# EAGLE design obd_driver_module (EAGLE 6.5.0)
DESCRIPTION: OBD-II, MS CAN, SW CAN Drivers; HW_REV: 1.1; PCB_REV: B; TITLE: OBD Driver Module

## Sheet 1 of 4
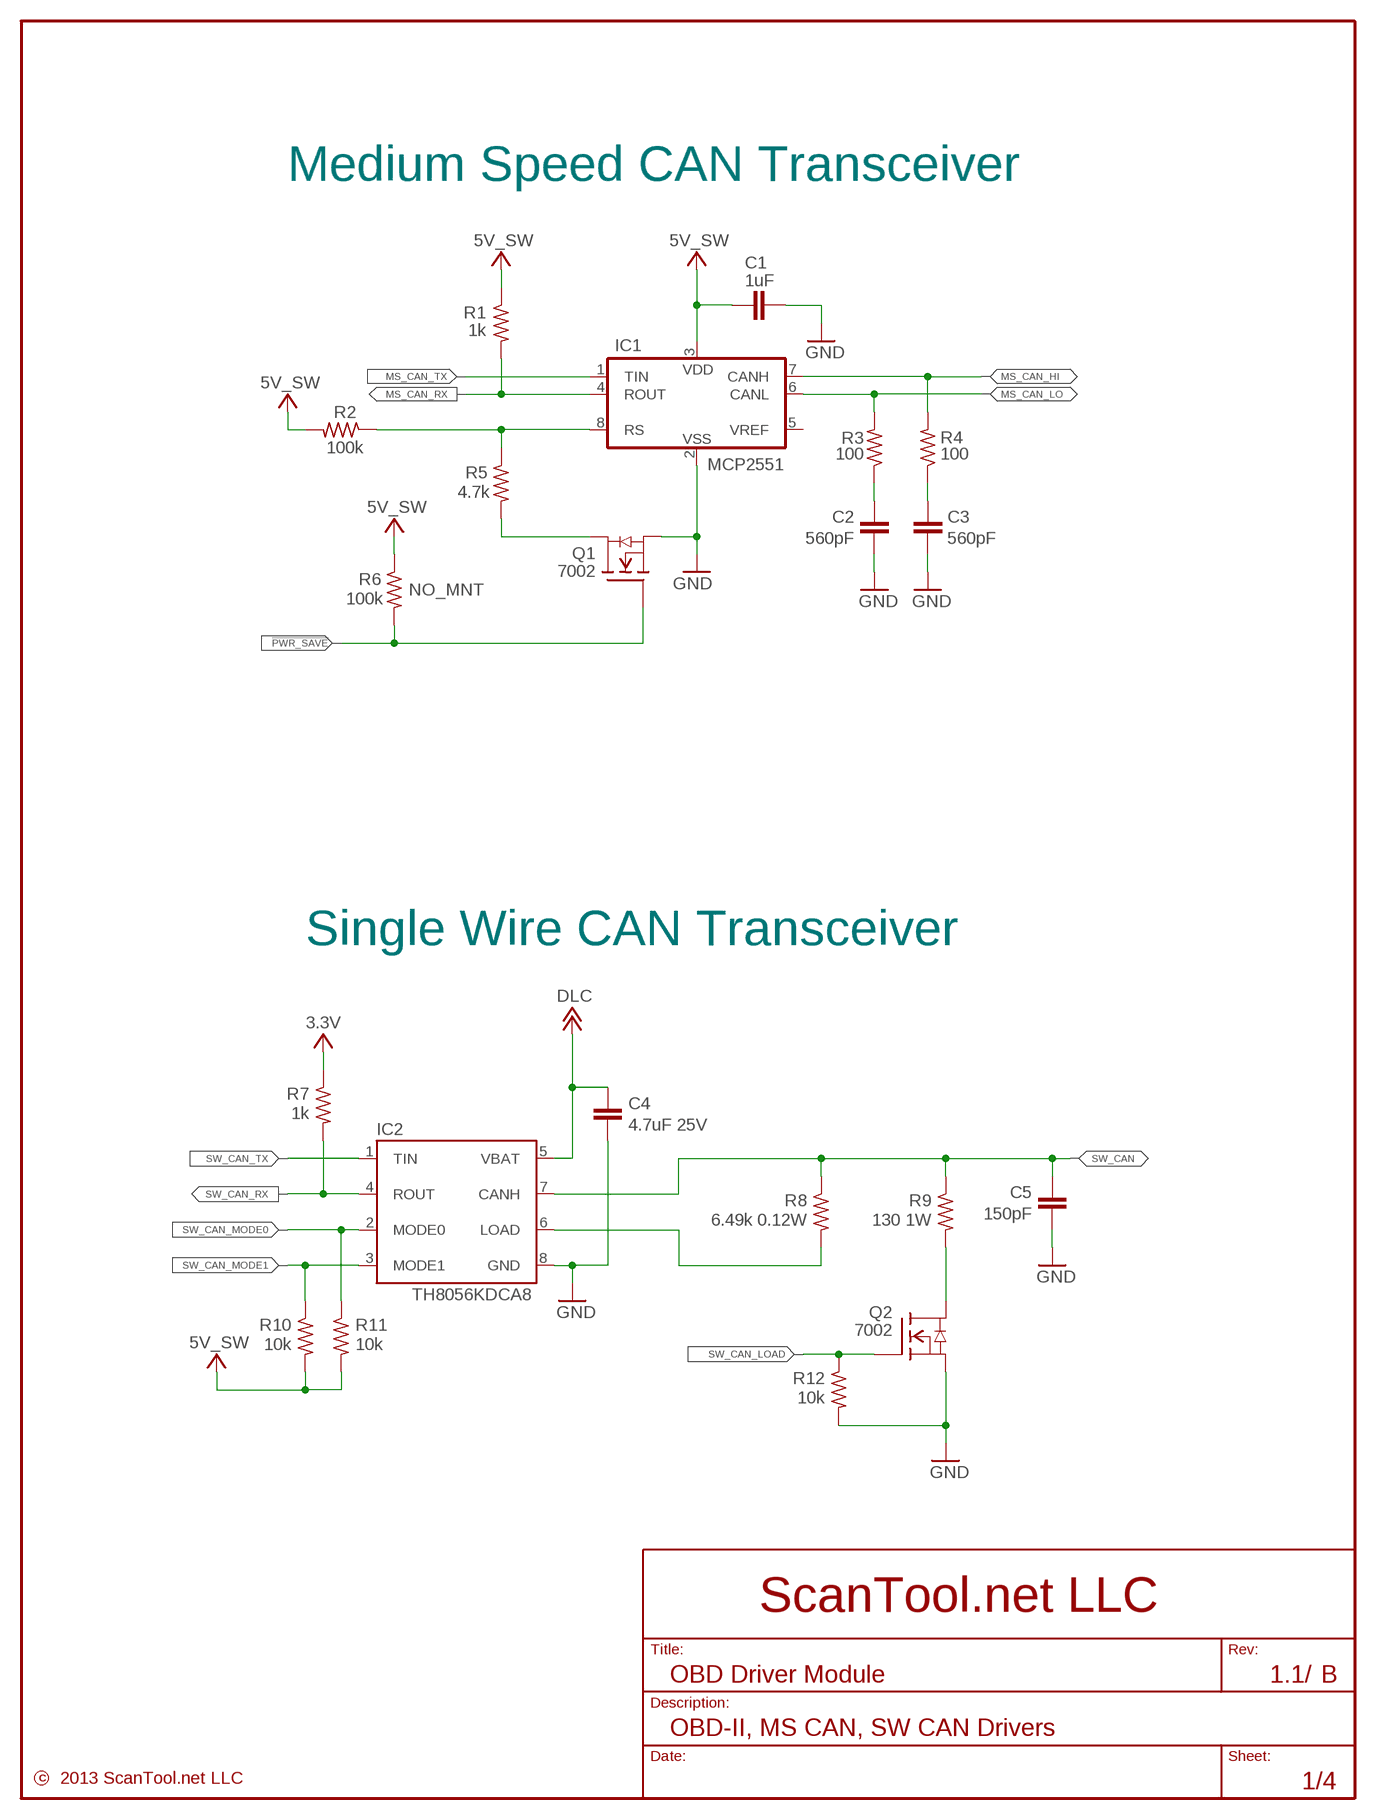
[diagram p0: schematic, sheet 1]

### Parts
C1  1uF  C-EU_0603  [0603]
C2  560pF  C-EU_0603  [0603]
C3  560pF  C-EU_0603  [0603]
C4  4.7uF 25V  C-EU_0805  [0805]
C5  150pF  C-EU_0603  [0603]
IC1  MCP2551  MCP2551-I/SN  [SO-8]
IC2  TH8056KDCA8  [SO-8]
Q1  7002  2N7002W  [SOT323-3]
Q2  7002  2N7002W  [SOT323-3]
R1  1k  R-US_0603  [0603]
R2  100k  R-US_0603  [0603]
R3  100  R-US_0603  [0603]
R4  100  R-US_0603  [0603]
R5  4.7k  R-US_0603  [0603]
R6  100k  R-US_0603  [0603]
R7  1k  R-US_0603  [0603]
R8  6.49k 0.12W  R-US_0603  [0603]
R9  130 1W  R-US_2512  [2512]
R10  10k  R-US_0603  [0603]
R11  10k  R-US_0603  [0603]
R12  10k  R-US_0603  [0603]

### Nets
3.3V [Supply]: R7.1 ; also sheet 2,3,4
5V_SW [Supply]: C1.1 IC1.3(VDD) R1.1 R2.2 R6.1 R10.2 R11.2 ; also sheet 2,3,4
!PWR_SAVE: Q1.1(G) R6.2 ; also sheet 3,4
DLC [Supply]: C4.2 IC2.5(VBAT) ; also sheet 3,4
GND [Supply]: C1.2 C2.2 C3.2 C4.1 C5.1 IC1.2(VSS) IC2.8(GND) Q1.2(S) Q2.2(S) R12.2 ; also sheet 2,3,4
MS_CAN_HI: IC1.7(CANH) R4.2 ; also sheet 4
MS_CAN_LO: IC1.6(CANL) R3.2 ; also sheet 4
MS_CAN_RX: IC1.4(ROUT) R1.2 ; also sheet 4
MS_CAN_TX: IC1.1(TIN) ; also sheet 4
N$5: C2.1 R3.1
N$7: C3.1 R4.1
N$8: IC1.8(RS) R2.1 R5.1
N$9 [Supply]: Q1.3(D) R5.2
N$41: IC2.6(LOAD) R8.2
N$45 [Signal-small]: Q2.3(D) R9.P$2
SW_CAN: C5.2 IC2.7(CANH) R8.1 R9.P$1 ; also sheet 4
SW_CAN_LOAD: Q2.1(G) R12.1 ; also sheet 4
SW_CAN_MODE0: IC2.2(MODE0) R11.1 ; also sheet 4
SW_CAN_MODE1: IC2.3(MODE1) R10.1 ; also sheet 4
SW_CAN_RX: IC2.4(ROUT) R7.2 ; also sheet 4
SW_CAN_TX: IC2.1(TIN) ; also sheet 4
Unconnected: IC1.5(VREF)

### Notes on the sheet
- Medium Speed CAN Transceiver
- Single Wire CAN Transceiver

## Sheet 2 of 4
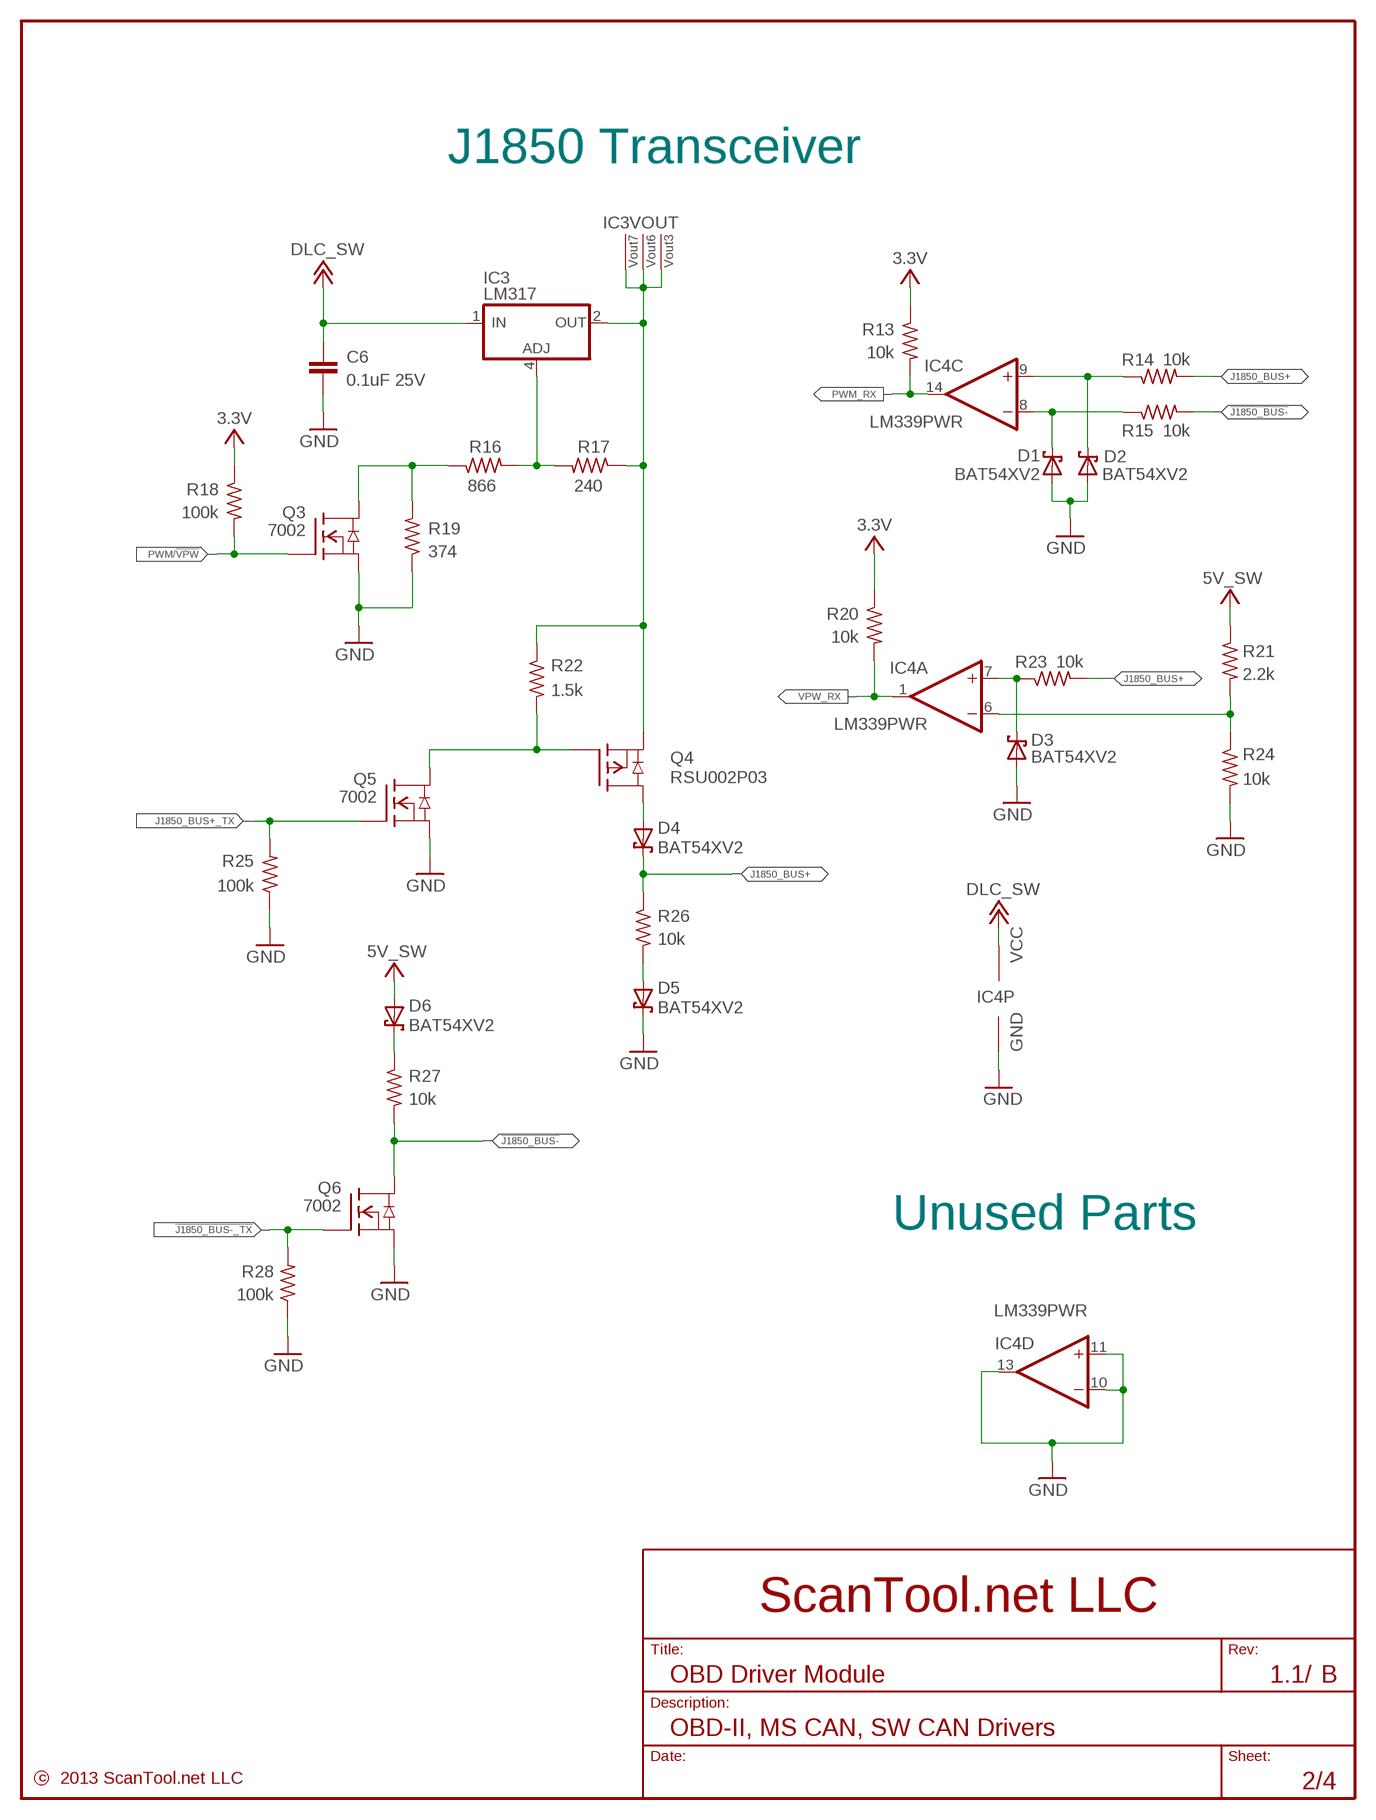
[diagram p1: schematic, sheet 2]

### Parts
C6  0.1uF 25V  C-EU_0603  [0603]
D1  BAT54XV2  [SOD-523F]
D2  BAT54XV2  [SOD-523F]
D3  BAT54XV2  [SOD-523F]
D4  BAT54XV2  [SOD-523F]
D5  BAT54XV2  [SOD-523F]
D6  BAT54XV2  [SOD-523F]
IC3  LM317  LM317LCPW  [TSSOP-8]
IC4  LM339PWR  [TSSOP-14]
Q3  7002  2N7002W  [SOT323-3]
Q4  RSU002P03  [SOT323-3]
Q5  7002  2N7002W  [SOT323-3]
Q6  7002  2N7002W  [SOT323-3]
R13  10k  R-US_0603  [0603]
R14  10k  R-US_0603  [0603]
R15  10k  R-US_0603  [0603]
R16  866  R-US_0603  [0603]
R17  240  R-US_0603  [0603]
R18  100k  R-US_0603  [0603]
R19  374  R-US_0603  [0603]
R20  10k  R-US_0603  [0603]
R21  2.2k  R-US_0603  [0603]
R22  1.5k  R-US_0603  [0603]
R23  10k  R-US_0603  [0603]
R24  10k  R-US_0603  [0603]
R25  100k  R-US_0603  [0603]
R26  10k  R-US_0603  [0603]
R27  10k  R-US_0603  [0603]
R28  100k  R-US_0603  [0603]

### Nets
3.3V [Supply]: R13.1 R18.1 R20.1 ; also sheet 1,3,4
5V_SW [Supply]: D6.A R21.1 ; also sheet 1,3,4
!J1850_BUS-: Q6.3(D) R15.2 R27.2 ; also sheet 4
!J1850_BUS-_TX: Q6.1(G) R28.2 ; also sheet 4
DLC_SW [Supply]: C6.1 IC3.1(IN) IC4.3(P:VCC) ; also sheet 3,4
GND [Supply]: C6.2 D1.A D2.A D3.A D5.C IC4.10(D:-IN) IC4.11(D:+IN) IC4.12(P:GND) IC4.13(D:OUT) Q3.2(S) Q5.2(S) Q6.2(S) R19.1 R24.2 R25.1 R28.1 ; also sheet 1,3,4
J1850_BUS+: D4.C R14.2 R23.2 R26.1 ; also sheet 4
J1850_BUS+_TX: Q5.1(G) R25.2 ; also sheet 4
N$6: D6.C R27.1
N$13: Q4.1(G) Q5.3(D) R22.2
N$16: Q3.3(D) R16.1 R19.2
N$18: D3.C IC4.7(A:+IN) R23.1
N$21: D5.A R26.2
N$26: IC3.4(ADJ) R16.2 R17.2
N$27: D4.A Q4.3(D)
N$29: D2.C IC4.9(C:+IN) R14.1
N$30: D1.C IC4.8(C:-IN) R15.1
N$43: IC4.6(A:-IN) R21.2 R24.1
OUT: IC3.2(OUT) IC3.3(OUT) IC3.6(OUT) IC3.7(OUT) Q4.2(S) R17.1 R22.1
PWM/!VPW: Q3.1(G) R18.2 ; also sheet 4
PWM_RX: IC4.14(C:OUT) R13.2 ; also sheet 4
VPW_RX: IC4.1(A:OUT) R20.2 ; also sheet 4

### Notes on the sheet
- J1850 Transceiver
- Unused Parts

## Sheet 3 of 4
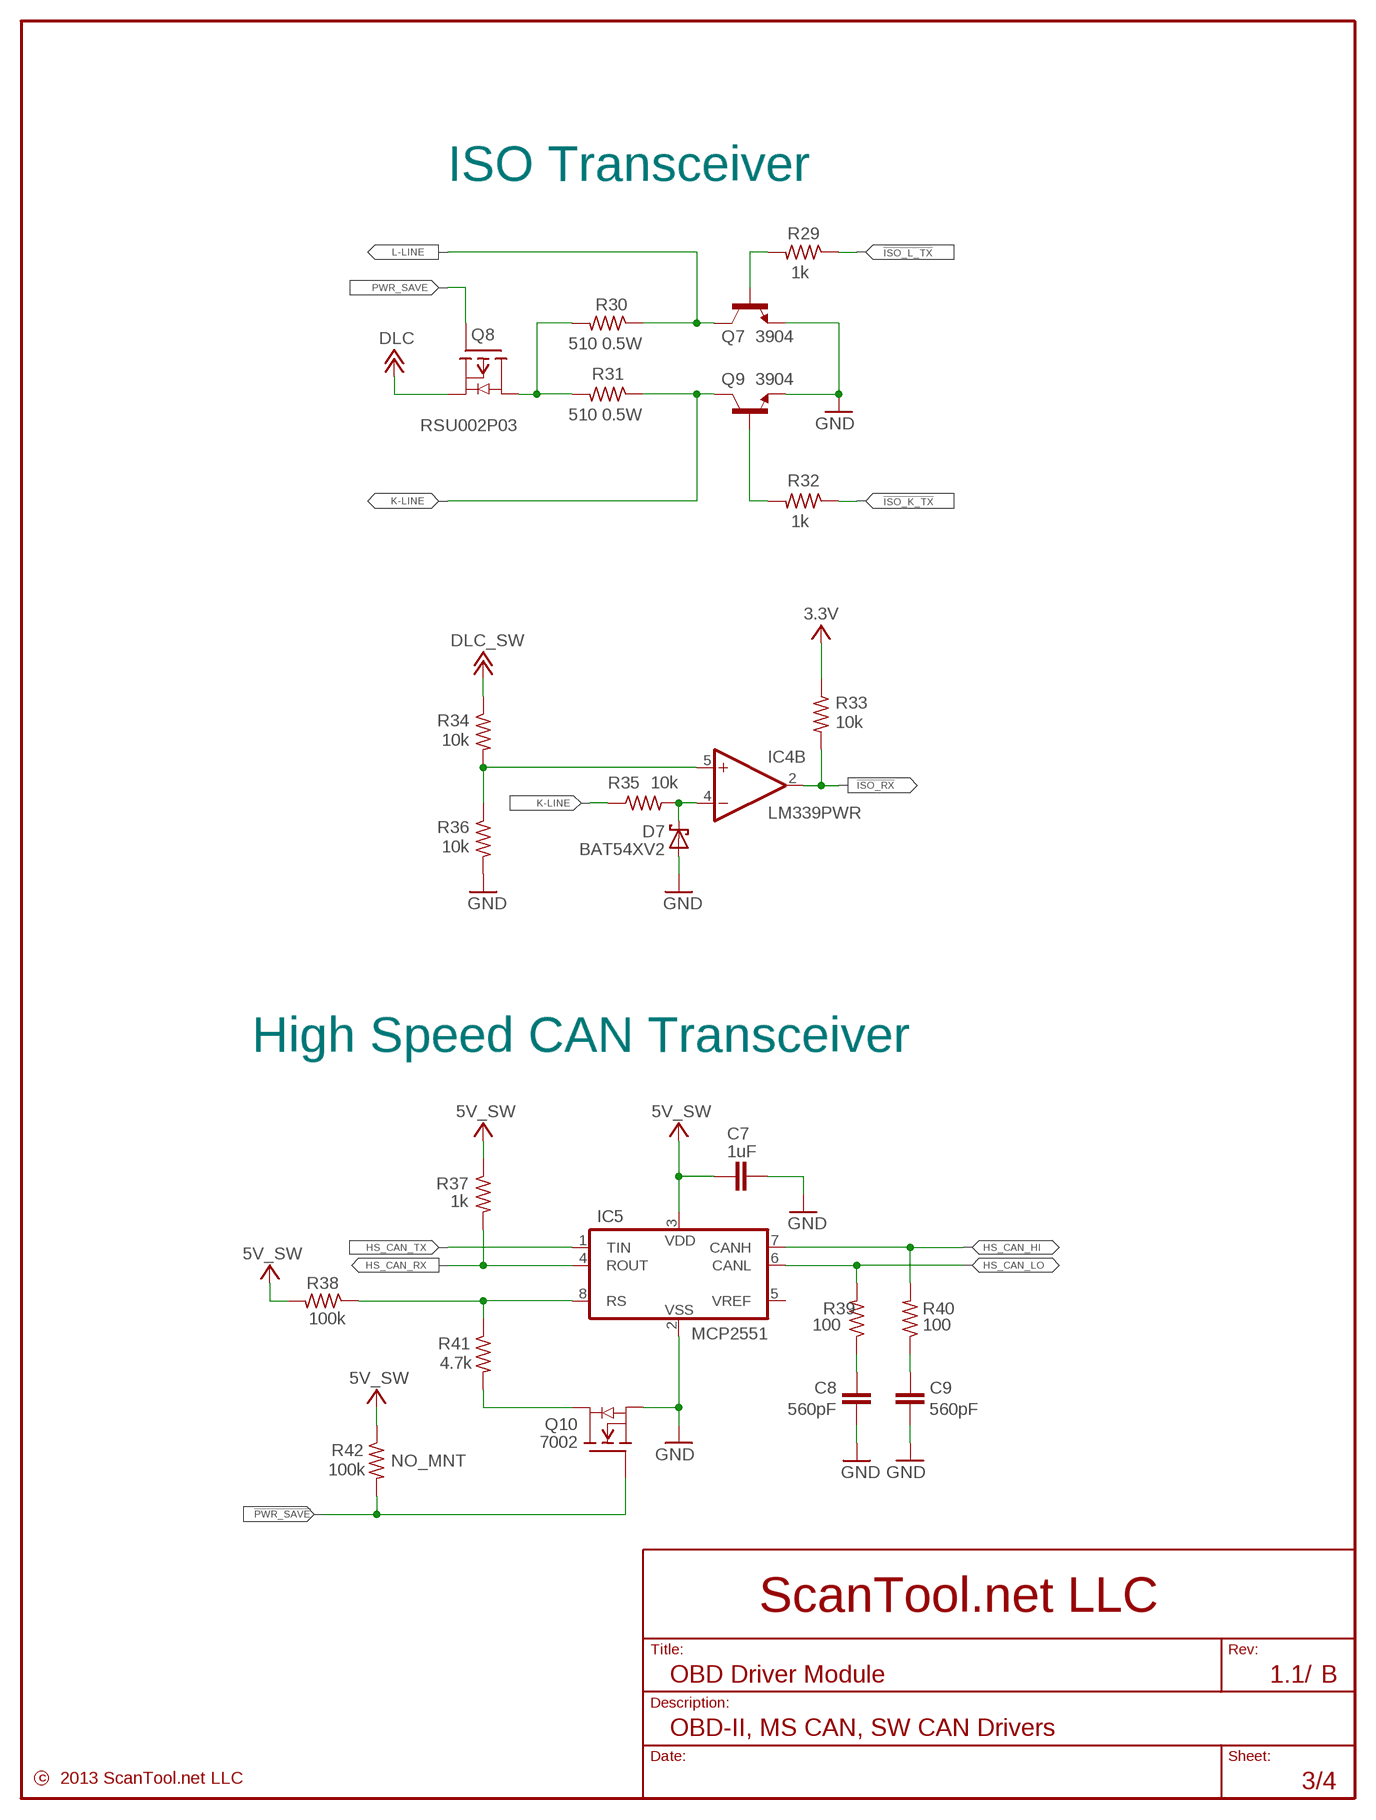
[diagram p2: schematic, sheet 3]

### Parts
C7  1uF  C-EU_0603  [0603]
C8  560pF  C-EU_0603  [0603]
C9  560pF  C-EU_0603  [0603]
D7  BAT54XV2  [SOD-523F]
IC5  MCP2551  MCP2551-I/SN  [SO-8]
Q7  3904  MMST3904  [SOT323-3]
Q8  RSU002P03  [SOT323-3]
Q9  3904  MMST3904  [SOT323-3]
Q10  7002  2N7002W  [SOT323-3]
R29  1k  R-US_0603  [0603]
R30  510 0.5W  R-US_1210  [1210]
R31  510 0.5W  R-US_1210  [1210]
R32  1k  R-US_0603  [0603]
R33  10k  R-US_0603  [0603]
R34  10k  R-US_0603  [0603]
R35  10k  R-US_0603  [0603]
R36  10k  R-US_0603  [0603]
R37  1k  R-US_0603  [0603]
R38  100k  R-US_0603  [0603]
R39  100  R-US_0603  [0603]
R40  100  R-US_0603  [0603]
R41  4.7k  R-US_0603  [0603]
R42  100k  R-US_0603  [0603]

### Nets
3.3V [Supply]: R33.1 ; also sheet 1,2,4
5V_SW [Supply]: C7.1 IC5.3(VDD) R37.1 R38.2 R42.1 ; also sheet 1,2,4
!ISO_K_TX: R32.1 ; also sheet 4
!ISO_L_TX: R29.1 ; also sheet 4
!ISO_RX: IC4.2(B:OUT) R33.2 ; also sheet 4
!PWR_SAVE: Q10.1(G) R42.2 ; also sheet 1,4
DLC [Supply]: Q8.2(S) ; also sheet 1,4
DLC_SW [Supply]: R34.1 ; also sheet 2,4
GND [Supply]: C7.2 C8.2 C9.2 D7.A IC5.2(VSS) Q7.2(E) Q9.2(E) Q10.2(S) R36.2 ; also sheet 1,2,4
HS_CAN_HI: IC5.7(CANH) R40.2 ; also sheet 4
HS_CAN_LO: IC5.6(CANL) R39.2 ; also sheet 4
HS_CAN_RX: IC5.4(ROUT) R37.2 ; also sheet 4
HS_CAN_TX: IC5.1(TIN) ; also sheet 4
K-LINE: Q9.3(C) R31.1 R35.1 ; also sheet 4
L-LINE: Q7.3(C) R30.1 ; also sheet 4
N$1: C8.1 R39.1
N$2: Q10.3(D) R41.2
N$3: Q7.1(B) R29.2
N$4 [Supply]: Q8.3(D) R30.2 R31.2
N$12: Q9.1(B) R32.2
N$14: D7.C IC4.4(B:-IN) R35.2
N$15: IC5.8(RS) R38.1 R41.1
N$19: IC4.5(B:+IN) R34.2 R36.1
N$40: C9.1 R40.1
PWR_SAVE: Q8.1(G) ; also sheet 4
Unconnected: IC5.5(VREF)

### Notes on the sheet
- ISO Transceiver
- High Speed CAN Transceiver

## Sheet 4 of 4
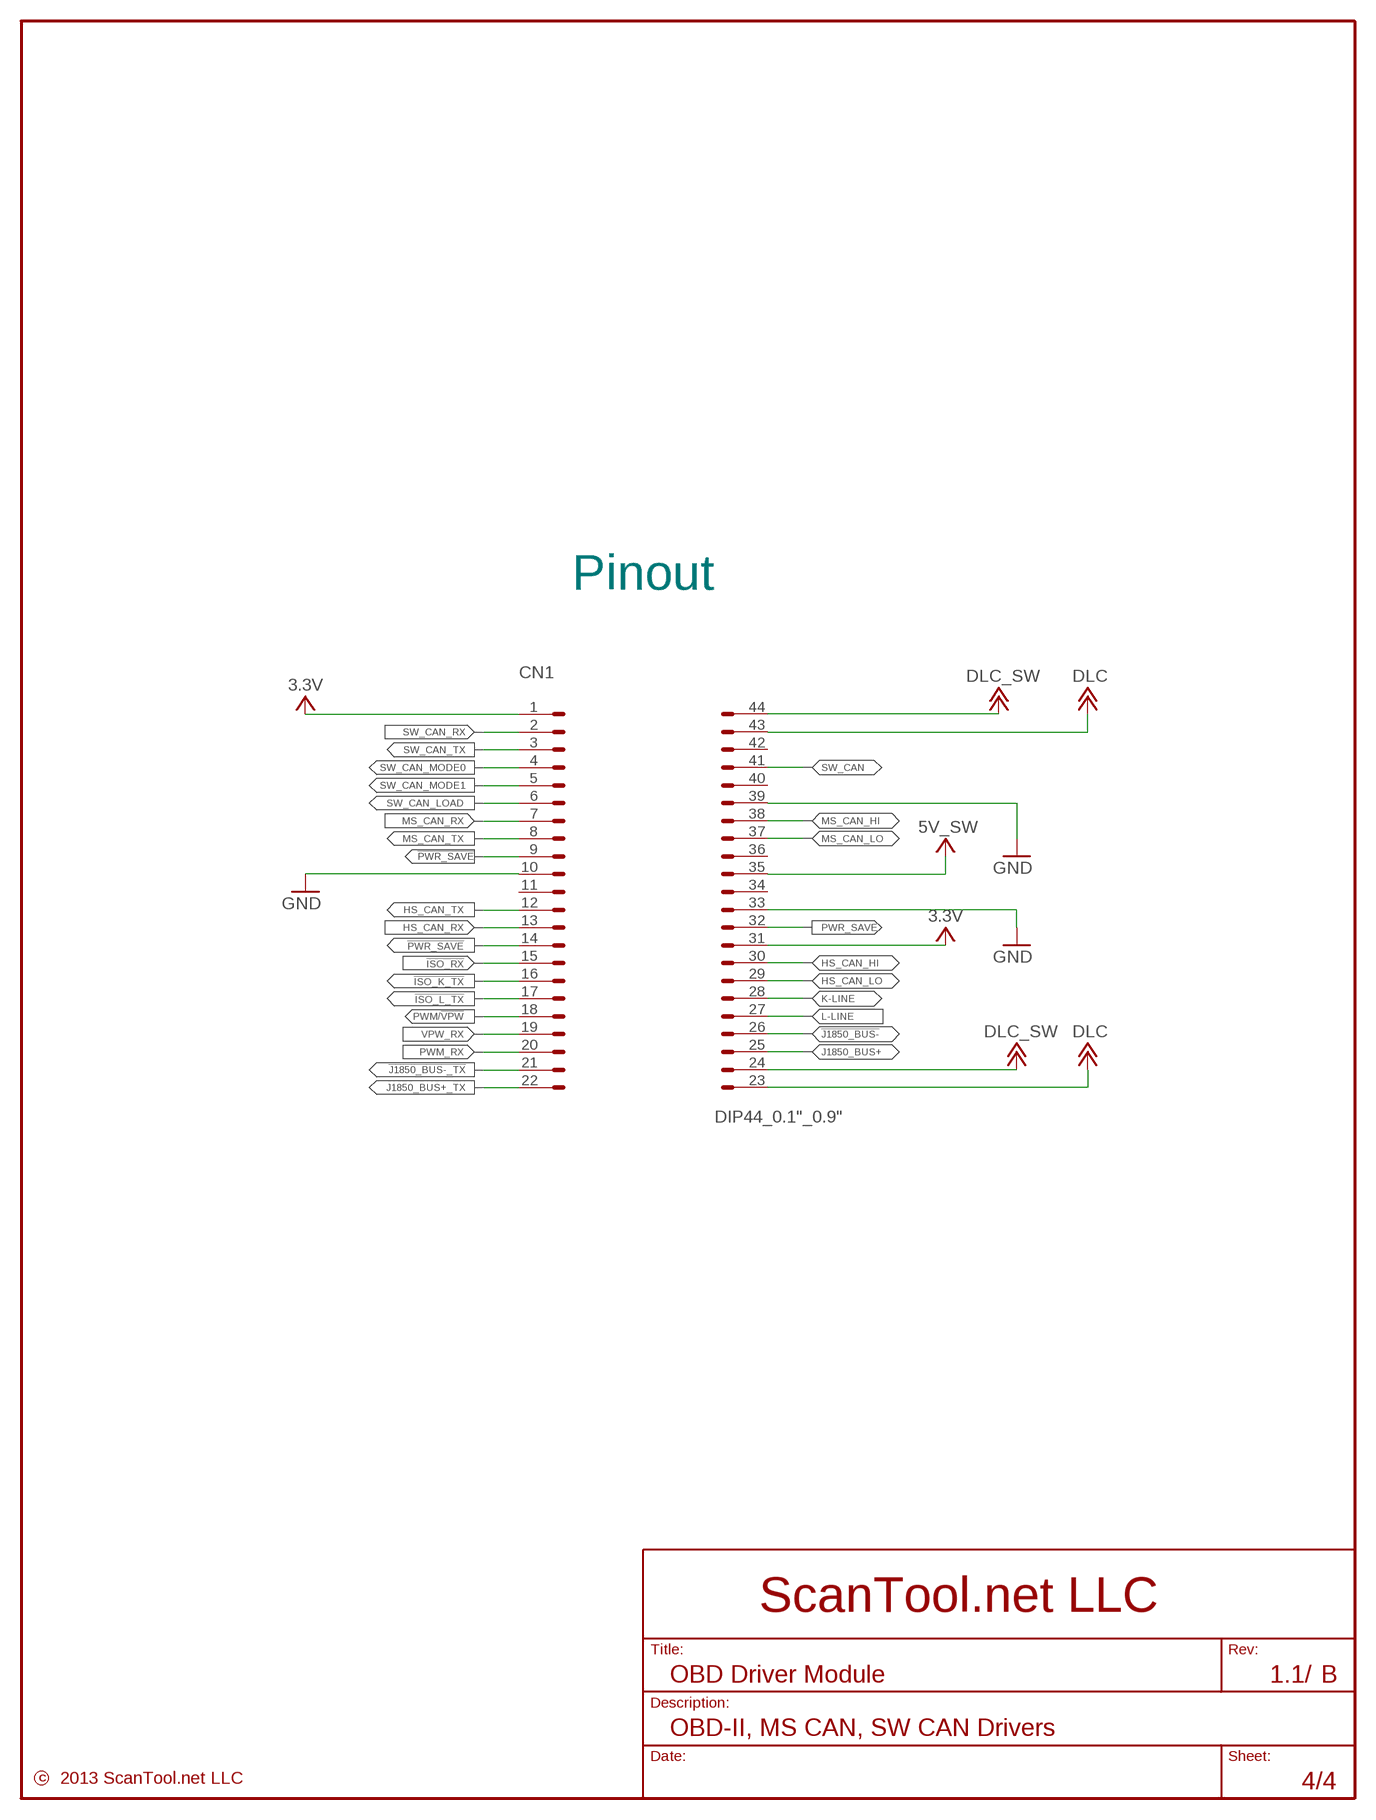
[diagram p3: schematic, sheet 4]

### Parts
CN1  DIP44_0.1"_0.9"  [DIP44_0.1"_0.9"]

### Nets
3.3V [Supply]: CN1.1 CN1.31 ; also sheet 1,2,3
5V_SW [Supply]: CN1.35 ; also sheet 1,2,3
!ISO_K_TX: CN1.16 ; also sheet 3
!ISO_L_TX: CN1.17 ; also sheet 3
!ISO_RX: CN1.15 ; also sheet 3
!J1850_BUS-: CN1.26 ; also sheet 2
!J1850_BUS-_TX: CN1.21 ; also sheet 2
!PWR_SAVE: CN1.9 CN1.14 ; also sheet 1,3
DLC [Supply]: CN1.23 CN1.43 ; also sheet 1,3
DLC_SW [Supply]: CN1.24 CN1.44 ; also sheet 2,3
GND [Supply]: CN1.10 CN1.33 CN1.39 ; also sheet 1,2,3
HS_CAN_HI: CN1.30 ; also sheet 3
HS_CAN_LO: CN1.29 ; also sheet 3
HS_CAN_RX: CN1.13 ; also sheet 3
HS_CAN_TX: CN1.12 ; also sheet 3
J1850_BUS+: CN1.25 ; also sheet 2
J1850_BUS+_TX: CN1.22 ; also sheet 2
K-LINE: CN1.28 ; also sheet 3
L-LINE: CN1.27 ; also sheet 3
MS_CAN_HI: CN1.38 ; also sheet 1
MS_CAN_LO: CN1.37 ; also sheet 1
MS_CAN_RX: CN1.7 ; also sheet 1
MS_CAN_TX: CN1.8 ; also sheet 1
PWM/!VPW: CN1.18 ; also sheet 2
PWM_RX: CN1.20 ; also sheet 2
PWR_SAVE: CN1.32 ; also sheet 3
SW_CAN: CN1.41 ; also sheet 1
SW_CAN_LOAD: CN1.6 ; also sheet 1
SW_CAN_MODE0: CN1.4 ; also sheet 1
SW_CAN_MODE1: CN1.5 ; also sheet 1
SW_CAN_RX: CN1.2 ; also sheet 1
SW_CAN_TX: CN1.3 ; also sheet 1
VPW_RX: CN1.19 ; also sheet 2
Unconnected: CN1.11 CN1.34 CN1.36 CN1.40 CN1.42

### Notes on the sheet
- Pinout

## Library data of the parts
C1-C9 = _stn_rcl:C-EU: Capacitor, European Symbol Change Log Date Author Change November 13, 2006 vit@scantool.net Moved underscore from the end of device name to beginning of variant names. May 27, 2006 vitaliy@scantool.net Added description; DESC: Capacitor; VALSTAT: VAL
CN1 = _stn_connector:DIP44_0.1": OBD-DRIVER-CONNECTOR Male, 22X2, 0.1" Pitch Based on 2 Standard 20X1 .01" pitch male headers. Change Log Date Author Change September 07, 2012 dduggan@scantool.net Device created.; DESC: Socket; PARTNUM: DIP 44 Pin Socket; VALSTAT: PARTNUM
D1-D7 = _stn_diode:BAT54: BAT54 Shotkey Diode Change Log Date Author Change September 26, 2012 dduggan @scantool.net Device created; DESC: Diode, Schottky; MANUF: Fairchild; PARTNUM: BAT54XV2; SUPPLIER: Digikey:BAT54XV2TR-ND; VALSTAT: PARTNUM
IC1 IC5 = _stn_microchip:MCP2551: CAN Driver Based on information from the MPC2551 datasheet from Microchip. http://www.microchip.com/ Note: with VDD dissconnected: TIN is a 5.45k to GND ROUT has 4.35k to GND Change Log Date Author Change November 12, 2008 joe@scantool.net Renamed "TXD" to "TIN" and "RXD" to "ROUT" Fixed mislabeled pins "CANH" and CANL"; DESC: IC, CAN Transceiver; MANUF: Microchip Technology; PARTNUM: MCP2551-I/SN; SUPPLIER: Digikey:MCP2551-I/SN-ND; VALSTAT: PARTNUM
IC2 = _stn_melexis:TH8056KDCA8: Single Wire CAN IC Based on information from the TH8056 datasheet from Melexis. Note: with VDD dissconnected: MODE0 has a 17.5k resistance to GND MODE1 has a 17.5k resistance to GND Change Log Date Author Change October 1, 2010 jason@scantool.net Created Device. February 2, 2011 jason@scantool.net Changed pin names to TIN and ROUT.; DESC: IC, Single Wire CAN; MANUF: Melexis; PARTNUM: TH8056KDCA8; SUPPLIER: Digikey:TH8056KDC-A8CT-ND; VALSTAT: PARTNUM
IC3 = _stn_vreg:LM317L*?: Voltage Regulator, Positive (Adjustable) Change Log Date Author Change November 15, 2010 dduggan @scantool.net Changed VOUT pins from request to must. May 15, 2006 vitaliy@scantool.net Moved to _stn_vreg.lbr from _st.lbr.; DESC: Voltage Reg. Adj.; MANUF: Texas Instruments; PARTNUM: LM317LCPWR; SUPPLIER: Digikey:296-17222-1-ND; VALSTAT: PARTNUM
IC4 = _stn_logic:LM339PWR: Quad Differential Comparators Based on information from the SLCS006N datasheet from TI (www.ti.com). Change Log Date Author Change July 16, 2008 joe@scantool.net Updated DESC. July 16, 2008 nick@scantool.net Device created.; DESC: IC, Comparator, Quad; MANUF: Texas Instruments; PARTNUM: LM339PWR; SUPPLIER: Digikey:296-6607-1-ND; VALSTAT: PARTNUM
Q1-Q3 Q5 Q6 Q10 = _stn_transistor:2N7002: MOSFET N_Channel Change Log Date Author Change July 9, 2008 joe@scantool.net Device package updated to revised SOT23 July 7, 2008 joe@scantool.net Created device.; DESC: Transistor, N-Channel; MANUF: ON Semiconductor; PARTNUM: 2N7002WT1G; SUBST: NO; SUPPLIER: Digikey:2N7002WT1GOSCT-ND; VALSTAT: PARTNUM
Q4 Q8 = _stn_transistor:RSU002P03; DESC: Transistor, P-Channel; MANUF: Rohm Semiconductor; PARTNUM: RSU002P03T106; SUPPLIER: Digikey:RSU002P03T106CT-ND; VALSTAT: PARTNUM
Q7 Q9 = _stn_transistor:?3904: PNP Transistor Low speed switching: 70nS On-Time, 250nS Off-Time (200mA Ic) Change Log Date Author Change June 30, 2010 jason@scantool.net Renamed device from 2N3904 to ?3904. April 5, 2010 joe@scantool.net Swapped collector and emitter pin assignments on SOT323-3 package April 5, 2010 joe@scantool.net Added Description.; DESC: Transistor, NPN; MANUF: ON Semiconductor; PARTNUM: MMBT3904WT1G; SUPPLIER: Digikey:MMBT3904WT1GOSCT-ND; VALSTAT: PARTNUM
R1-R8 R10-R42 = _stn_rcl:R-US: Resistor, US Symbol Change Log Date Author Change November 23, 2010 bpond@scantool.net Added 0309/12 package. November 18, 2010 vitaliy@scantool.net Verified device. November 18, 2010 bpond@scantool.net Added 0207/10 package. November 13, 2006 vit@scantool.net Moved underscore from the end of device name to beginning of variant names. May 27, 2006 vitaliy@scantool.net Added description.; DESC: Resistor; VALSTAT: VAL
R9 = _stn_rcl:R-US: Resistor, US Symbol Change Log Date Author Change November 23, 2010 bpond@scantool.net Added 0309/12 package. November 18, 2010 vitaliy@scantool.net Verified device. November 18, 2010 bpond@scantool.net Added 0207/10 package. November 13, 2006 vit@scantool.net Moved underscore from the end of device name to beginning of variant names. May 27, 2006 vitaliy@scantool.net Added description.; DESC: Resistor

## Net classes
0 Normal: width 0.254 mm, drill 0.406 mm, clearance 0.203 mm
1 Supply: width 0.254 mm, drill 0.457 mm, clearance 0.203 mm
2 Vdlc: width 0.254 mm, drill 0.457 mm, clearance 0.203 mm
3 Signal-small: width 0.254 mm, drill 0.457 mm, clearance 0.203 mm

## Board
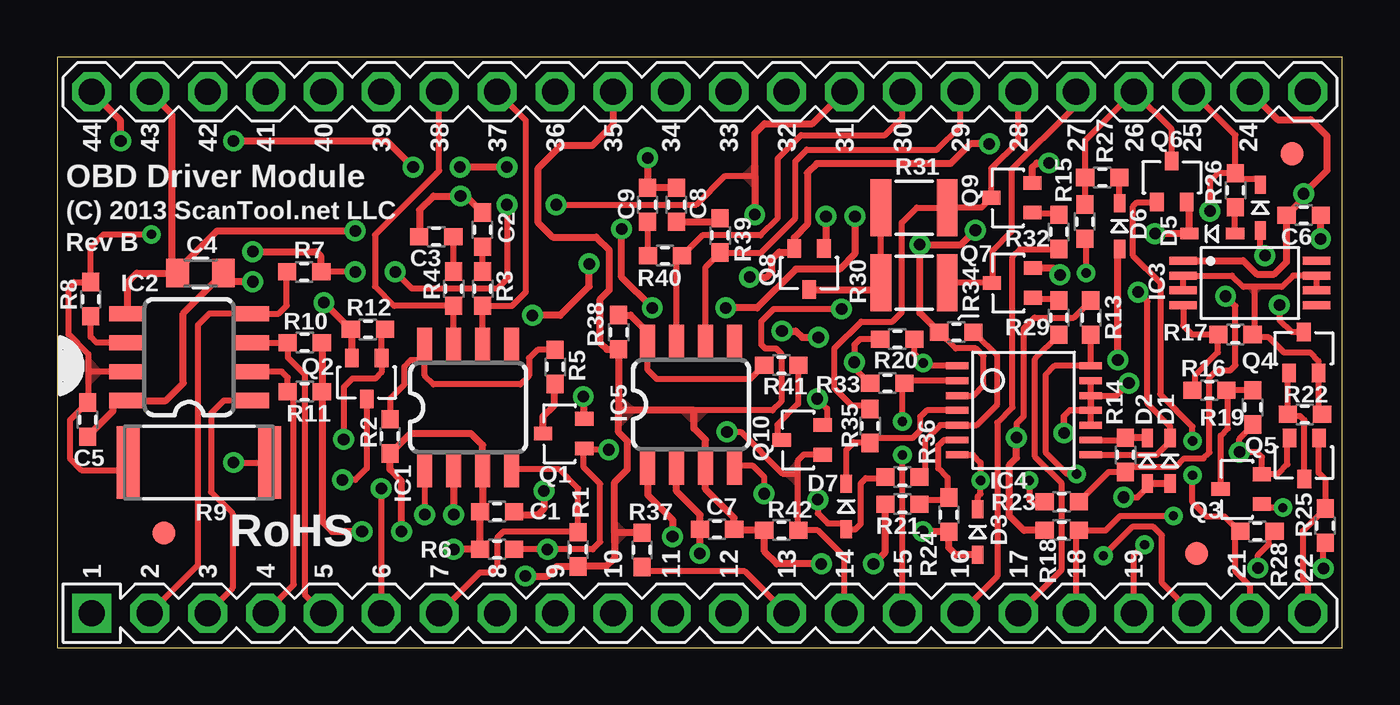
[diagram p4: board, top side]
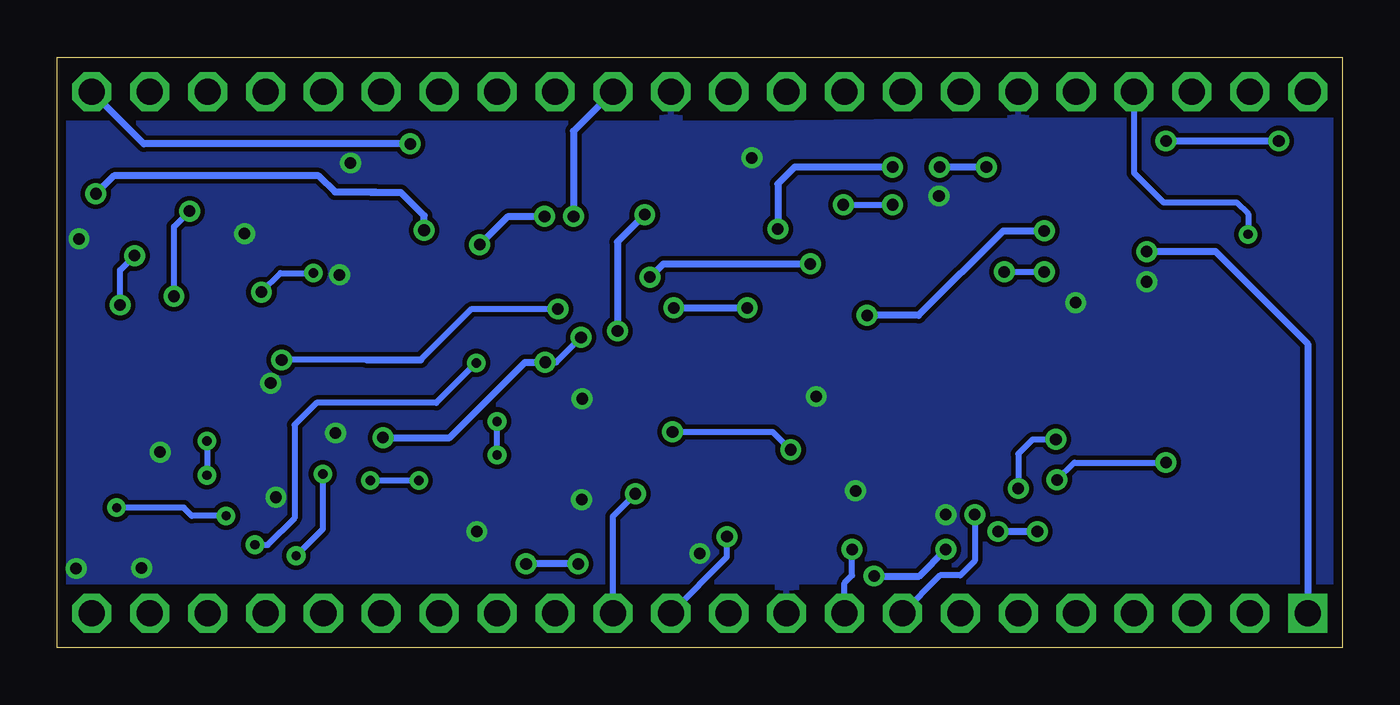
[diagram p5: board, bottom side, seen from below]

Size 56.39 x 25.91 mm. Coordinates in mm from the lower left corner, seen from the top.
Outline: 0,0 56.39,0 56.39,25.91 0,25.91 0,0
Copper layers (1*16): Top 0.035mm / dielectric 1.5mm / Bottom 0.035mm
Design rules "default": minimum track width 10mil, minimum drill 15mil, track to track 8mil, track to pad 8mil, pad to pad 8mil, via to via 8mil, smd to smd 4mil, copper to edge 15mil, drill to drill 8mil, minimum pad ring 10mil, minimum via ring 8mil, stop-mask expansion 4mil, vias tented up to drill 20mil, thermal gap 6mil

### Footprints (pad centres in the part's own frame; a part is rotated, then mirrored left to right if it is on the bottom)
0603 = smd 0.8 x 0.75: 1 -0.75,0; 2 0.75,0
0805 = smd 1 x 1.25: 1 -1,0; 2 1,0
DIP44_0.1"_0.9" = drill 1.143 square: 1 -11.43,26.67 | drill 1.143 octagon: 2 -11.43,24.13; 3 -11.43,21.59; 4 -11.43,19.05; 5 -11.43,16.51; 6 -11.43,13.97; 7 -11.43,11.43; 8 -11.43,8.89; 9 -11.43,6.35; 10 -11.43,3.81; 11 -11.43,1.27; 12 -11.43,-1.27; 13 -11.43,-3.81; 14 -11.43,-6.35; 15 -11.43,-8.89; 16 -11.43,-11.43; 17 -11.43,-13.97; 18 -11.43,-16.51; 19 -11.43,-19.05; 20 -11.43,-21.59; 21 -11.43,-24.13; 22 -11.43,-26.67; 23 11.43,-26.67; 24 11.43,-24.13; 25 11.43,-21.59; 26 11.43,-19.05; 27 11.43,-16.51; 28 11.43,-13.97; 29 11.43,-11.43; 30 11.43,-8.89; 31 11.43,-6.35; 32 11.43,-3.81; 33 11.43,-1.27; 34 11.43,1.27; 35 11.43,3.81; 36 11.43,6.35; 37 11.43,8.89; 38 11.43,11.43; 39 11.43,13.97; 40 11.43,16.51; 41 11.43,19.05; 42 11.43,21.59; 43 11.43,24.13; 44 11.43,26.67
SOD-523F = smd 0.8 x 0.5: A -1,0; C 1,0
FIDUCIAL_40X100 = smd 1.016 x 1.016: P$1 0,0
SO-8 = smd 0.66 x 1.626: 1 -1.905,-2.692; 2 -0.635,-2.692; 3 0.635,-2.692; 4 1.905,-2.692; 5 1.905,2.692; 6 0.635,2.692; 7 -0.635,2.692; 8 -1.905,2.692
TSSOP-8 = smd 0.35 x 1.2: 1 -0.975,-2.925; 2 -0.325,-2.925; 3 0.325,-2.925; 4 0.975,-2.925; 5 0.975,2.925; 6 0.325,2.925; 7 -0.325,2.925; 8 -0.975,2.925
TSSOP-14 = smd 0.305 x 0.991: 1 -1.95,-2.925; 2 -1.3,-2.925; 3 -0.65,-2.925; 4 0,-2.925; 5 0.65,-2.925; 6 1.3,-2.925; 7 1.95,-2.925; 8 1.95,2.925; 9 1.3,2.925; 10 0.65,2.925; 11 0,2.925; 12 -0.65,2.925; 13 -1.3,2.925; 14 -1.95,2.925
SOT323-3 = smd 0.6 x 0.8: 1 -0.65,-0.9; 2 0.65,-0.9; 3 0,0.9
2512 = smd 1 x 3.2: P$1 -3.1,0; P$2 3.1,0
1210 = smd 0.9 x 2.5: 1 -1.45,0; 2 1.45,0

### Placement (x,y rotation side)
C1  19.3,5.97 0 top
C2  18.67,18.34 90 top
C3  16.64,18.03 180 top
C4  6.3,16.43 180 top
C5  1.35,10.01 90 top
C6  54.69,18.97 0 top
C7  28.96,5.21 180 top
C8  27.18,19.43 90 top
C9  25.91,19.43 90 top
CN1  28.19,12.95 90 top
D1  48.82,8.2 90 top
D2  47.83,8.2 90 top
D3  40.39,5.08 90 top
D4  52.78,19.3 90 top
D5  50.67,18.16 180 top
D6  46.61,18.49 90 top
D7  34.62,6.2 90 top
E$4  [FIDUCIAL_40X100]  4.7,5.03 0 top
E$5  [FIDUCIAL_40X100]  49.99,4.14 0 top
E$6  [FIDUCIAL_40X100]  54.18,21.67 0 top
IC1  18.03,10.54 0 top
IC2  5.79,12.75 90 top
IC3  52.32,16 270 top
IC4  42.42,10.41 270 top
IC5  27.81,10.67 0 top
Q1  22.23,9.4 90 top
Q2  13.59,11.81 180 top
Q3  51.94,6.96 90 top
Q4  54.69,12.95 0 top
Q5  54.71,8.31 180 top
Q6  48.9,20.45 0 top
Q7  41.91,16 90 top
Q8  32.99,16.61 180 top
Q9  41.88,19.74 90 top
Q10  32.69,9.12 90 top
R1  22.86,4.32 90 top
R2  14.61,9.27 270 top
R3  18.67,15.75 270 top
R4  17.4,15.75 270 top
R5  21.84,12.32 270 top
R6  19.3,4.32 0 top
R7  10.85,16.48 180 top
R8  1.47,15.29 270 top
R9  6.22,8.13 0 top
R10  10.87,13.39 0 top
R11  10.87,11.23 0 top
R12  13.64,13.97 180 top
R13  45.34,14.48 270 top
R14  46.86,8.46 270 top
R15  45.09,18.69 90 top
R16  50.55,11.3 180 top
R17  51.69,13.74 180 top
R18  44.07,5.16 0 top
R19  52.45,10.54 90 top
R20  36.86,13.54 0 top
R21  37.08,6.3 0 top
R22  54.74,10.24 180 top
R23  44.07,6.4 0 top
R24  39.12,5.84 270 top
R25  55.63,5.36 90 top
R26  51.69,20.07 270 top
R27  45.85,20.62 180 top
R28  52.65,5.11 180 top
R29  43.94,14.48 90 top
R30  37.59,16 180 top
R31  37.59,19.3 180 top
R32  43.94,18.24 90 top
R33  36.42,11.61 0 top
R34  39.45,13.84 0 top
R35  35.66,9.73 270 top
R36  37.08,7.49 180 top
R37  25.65,4.29 270 top
R38  24.64,13.84 270 top
R39  29.08,18.08 270 top
R40  26.67,17.2 0 top
R41  31.78,12.4 0 top
R42  31.78,5.16 0 top

### Tracks (layer width: path | path; a pad name or v marks a point on that pad's centre or on a via)
3.3V  (via drill 0.51)
  Top 0.254: R13.1 45.09,14.97 45.09,14.96 44.6,14.48 42.88,14.48 42.39,13.99 42.39,10.13 42.09,9.83 v42.09,9.22 | v19.74,19.43 19.74,16.18 19.3,15.75 15.57,15.75 v14.83,16.48 | 30.58,20.7 30.61,20.68 | 30.58,20.7 30.61,20.73 | v21.89,19.43 28.04,19.43 29.31,20.7 30.58,20.7 | R20.1 35.23,13.54 34.98,13.28 v34.98,12.52 34.98,12.27 35.64,11.61 R33.1 | v13.08,16.48 R7.1
  Top 0.305: R18.1 42.42,5.16 41.78,5.79 41.78,8.03 42.09,8.33 v42.09,9.22 | 30.61,20.68 v30.61,19 | 30.61,20.73 30.61,22.55 31.04,22.99 33.15,22.99 CN1.31 | 30.56,20.68 30.58,20.7 | v8.59,17.37 11.38,17.37 11.56,17.2 11.56,16.52 R7.1 | v31.8,13.89 32.41,13.89 32.69,13.61 v33.4,13.61
  Bottom 0.254: v21.89,19.43 v19.74,19.43 | 42.06,9.2 v42.09,9.22 | v14.83,16.48 v13.08,16.48 | v33.4,13.61 34.49,12.52 v34.98,12.52
  Bottom 0.305: 42.06,9.2 39.19,9.2 35.87,12.52 v34.98,12.52 | v8.59,17.37 5.56,17.37 1.52,13.34 CN1.1 | v30.61,19 31.8,17.8 v31.8,13.89
  pour Top: 30.61,21.13 30.61,20.27 30.18,20.7
5V_SW  (via drill 0.51)
  Top 0.254: 27.94,10.41 31.39,10.41 31.77,10.79 31.77,12.9 31.55,13.13 31.06,13.13 30.89,13.31 30.89,14.3 31.45,14.86 v34.42,14.86 | 46.53,17.41 D6.A
  Top 0.305: v17.4,4.32 R6.1 C1.1 18.67,6.08 IC1.3 18.67,8.89 18.16,9.4 15.49,9.4 R2.2 14.61,7.82 15.11,7.32 v15.11,5.11 | v20.55,3.15 21.51,3.15 21.93,3.57 R1.1 24.09,3.57 24.46,3.94 24.46,5.05 | 24.64,10.41 R38.2 24.12,13.09 23.82,13.39 23.82,15.29 24.23,15.7 24.23,17.42 23.65,18.01 21.74,18.01 21.08,18.67 21.08,21.01 22.1,22.02 23.47,22.02 24.38,22.94 CN1.35 | v35.81,3.68 36.33,4.2 R21.1 | v46.53,12.62 46.53,17.41 | 24.64,10.41 27.94,10.41 27.94,9.63 28.45,9.12 IC5.3 28.45,6.96 29.71,5.7 C7.1 29.73,5.18 31,5.18 R42.1 31.04,5.14 31.04,4.22 31.57,3.68 v33.53,3.68 | 24.64,10.41 24.64,9.45 25.02,9.07 25.02,7.82 24.46,7.26 24.46,5.05 | R10.2 R11.2 | R11.2 11.61,11.23 | R11.2 11.62,5.55 12.06,5.11 v13.39,5.11 | R37.1 24.47,5.04 24.46,5.05
  Bottom 0.254: 42.8,12.62 v46.53,12.62 | 40.44,12.62 38.2,14.86 v34.42,14.86
  Bottom 0.305: 42.8,12.62 40.44,12.62 | v20.55,3.15 18.57,3.15 v17.4,4.32 | v33.53,3.68 v35.81,3.68 | v15.11,5.11 v13.39,5.11
  pour Top: 27.43,10.41 28.45,10.41 27.94,9.91
  pour Top: 24.64,10.92 24.64,9.78 25.27,10.41
  pour Top: 24.46,5.46 24.89,5.03 24.46,4.6
!ISO_K_TX
  Top 0.254: R32.1 42.25,17.49 41.91,17.14 41.91,10.54 41.25,9.88 41.25,3.15 CN1.16
!ISO_L_TX
  Top 0.254: CN1.17 44.07,3.43 44.07,7.21 42.9,8.38 42.9,12.68 43.94,13.72 R29.1
!ISO_RX  (via drill 0.41)
  Top 0.254: IC4.2 37.28,11.71 R33.2 | 37.21,11.57 R33.2 | CN1.15 v37.08,8.46 | v37.08,9.93 37.08,11.52 R33.2
  Bottom 0.254: v37.08,8.46 v37.08,9.93
!J1850_BUS-
  Top 0.254: Q6.3 48.9,22.73 CN1.26 45.1,22.24 R27.2 45.09,20.61 R15.2
!J1850_BUS-_TX  (via drill 0.41)
  Top 0.254: Q6.1 48.23,19.53 47.37,19.53 47.19,19.36 47.19,17.2 48.39,16 48.39,11.12 49.81,9.7 v49.81,9.07 | CN1.21 52.32,2.72 51.69,3.35 51.69,4.83 51.9,5.04 R28.2 51.65,5.36 51.61,5.36 51.21,5.77 50.42,5.77 49.81,6.38 v49.81,7.57
  Bottom 0.254: v49.81,9.07 v49.81,7.57
!PWR_SAVE  (via drill 0.51)
  Top 0.254: R6.2 v21.51,4.32 23.5,4.32 23.82,4.65 23.82,7.19 23.1,7.91 23.1,8.72 Q1.1 23.19,8.69 v24.21,8.69 | v29.39,9.47 30,9.47 31.83,7.64 32.49,7.64 | 32.49,7.64 32.49,8.2 32.75,8.47 Q10.1 | CN1.14 34.54,3.99 33.38,5.16 R42.2 32.49,5.2 32.49,7.64
  Bottom 0.254: CN1.9 21.84,2.85 21.51,3.17 v21.51,4.32 | v29.39,9.47 24.99,9.47 v24.21,8.69
  pour Top: 32.49,7.19 32.03,7.65 32.49,8.1
DLC  (via drill 0.51)
  Top 0.305: IC2.5 3.1,16.03 3.5,16.43 5.03,16.43 | v40.89,22.1 40.06,22.1 39.19,21.23 33.33,21.23 32.92,20.83 32.92,18.57 32.34,17.99 Q8.2 32.18,17.35 31.67,17.35 31.37,17.04 31.37,16.51 31.11,16.26 v30.38,16.26 | v20.85,14.58 22.07,14.58 23.34,15.85 v23.34,16.84 | C4.2 5.56,16.7 5.56,16.82 7.04,18.29 v13.08,18.29 | 5.35,16.48 C4.2 | CN1.43 5.03,23.42 5.03,16.43 | 5.03,16.43 C4.2
  Bottom 0.305: CN1.23 52.58,22.1 v40.89,22.1 | v20.85,14.58 18.59,14.58 14.88,18.29 v13.08,18.29 | v30.38,16.26 29.79,16.84 v23.34,16.84
DLC_SW  (via drill 0.51)
  Top 0.254: IC4.3 40.2,11.06 40.64,11.51 40.64,12.79 40.3,13.13 39.42,13.13 R34.1
  Top 0.305: IC3.1 52.03,16.98 52.63,16.38 53.39,16.38 53.94,16.93 C6.1 54.69,19.72 v54.69,19.91 55.7,20.93 55.7,22.45 54.99,23.16 53.54,23.16 CN1.24 | v26.11,14.91 24.77,16.26 v24.77,18.36 | R34.1 37.85,14.69 v37.85,17.68 39.65,17.68 v40.28,18.31 | v19.74,21.08 v17.68,21.08 | v7.75,22.23 14.48,22.23 v15.62,21.08 | v2.79,22.23 2.79,23.11 CN1.44 | v35,18.92 35,17.27 34.34,16.61 32.41,16.61 30.71,14.91 v29.34,14.91
  Bottom 0.254: 42.62,19.96 42.65,19.99
  Bottom 0.305: v2.79,22.23 v7.75,22.23 | 42.39,19.99 42.65,19.99 44.2,19.99 44.91,20.7 53.9,20.7 v54.69,19.91 | v15.62,21.08 v17.68,21.08 | v29.34,14.91 v26.11,14.91 | v40.28,18.31 40.28,18.95 41.3,19.96 42.62,19.96 | v19.74,21.08 24.03,21.08 24.77,20.34 v24.77,18.36 | v37.85,17.68 36.6,18.92 v35,18.92
GND  (via drill 0.51)
  Top 0.254: 42.95,16.51 Q7.2 | D5.C | 49.67,19.67 Q6.2 49.67,19.42 | IC4.10 IC4.11 | IC4.12 IC4.13 | 25.97,20.12 C9.2 | 47.83,7.19 D2.A 47.83,7.04 47.4,6.6 v46.79,6.6 | 45.38,11.06 46.47,11.06 v47.02,11.61 | v33.35,10.92 33.78,10.49 33.78,9.96 Q10.2 | 36.31,7.47 R36.2 36.28,7.44 35.48,7.44 35.26,7.21 35.26,5.44 35.02,5.2 D7.A 34.54,5.27 34.54,5.46 33.81,5.46 33.38,5.89 v33.38,6.5 | 52.43,9.77 R19.1 52.27,9.61 52.27,9.58 51.87,9.17 v51.87,8.59 52.63,8.59 52.85,8.36 52.85,7.62 | v55.55,3.48 55.55,4.53 R25.1 | 52.85,7.62 53.54,7.62 53.97,8.05 53.97,9.12 Q5.2 | 52.85,7.62 Q3.2 | v52.68,3.5 52.68,4.06 53.16,4.55 53.16,4.86 R28.1
  Top 0.279: v44.17,9.42 44.17,10.16 44.42,10.41 IC4.11 IC4.12 | 45.38,11.06 45.36,11.05
  Top 0.305: IC1.2 v17.4,5.84 | IC5.2 27.18,6.86 28.21,5.83 C7.2 28.19,5.2 v28.19,4.14 | D5.C 49.67,19.42 | 25.98,20.11 C9.2 | v43.99,16.36 43.7,16.65 Q7.2 | v25.91,21.49 C9.2 | C2.2 17.95,19.81 v17.7,19.81 16.51,19.81 15.9,19.2 15.9,18.05 C3.2 | v21.36,6.88 21.36,6.1 21.08,5.82 20.21,5.82 C1.2 | C8.2 C9.2 | D1.A D2.A 47.8,7.18 47.8,6.99 | v37.97,5.11 39.1,5.11 R24.2 39.12,4.39 39.43,4.08 D3.A | R12.2 12.9,13.98 12.86,13.98 | Q2.2 12.94,13.92 R12.2 | C5.1 1.35,9.27 2.46,10.39 2.46,10.59 2.69,10.82 3.07,10.82 IC2.8 4.78,10.85 5.54,11.61 5.54,14.67 C4.1 7.68,16.05 v8.59,16.05 | v11.71,15.14 12.68,14.17 12.69,14.17 R12.2 | C6.2 55.42,18.96 v55.42,17.93 | Q9.2 42.78,21.07 42.98,21.26 v43.51,21.26 | D5.C v48.16,18.16 | v23.09,11.02 23.09,10.08 Q1.2
  pour Bottom: 0.38,23.11 13.87,23.11 13.87,24.36 14.58,24.36 14.58,23.09 15.37,23.11 25.78,22.99 29.06,22.99 29.06,24.38 29.84,24.38 29.84,22.99 56.01,22.99 56.01,2.92 24.79,2.92 24.79,1.45 23.95,1.47 23.95,2.92 0.38,2.92
HS_CAN_HI
  Top 0.254: CN1.30 37.08,23.24 36.32,22.48 32.64,22.48 31.62,21.46 31.62,18.85 30.86,18.09 28.7,18.09 28.31,18.09 R40.2 27.18,16.95 IC5.7
HS_CAN_LO
  Top 0.254: CN1.29 39.62,22.86 38.61,21.84 32.89,21.84 32.38,21.34 32.38,18.85 30.87,17.34 R39.2 28.45,16.7 IC5.6
HS_CAN_RX  (via drill 0.51)
  Top 0.254: CN1.13 30.18,3.35 25.84,3.35 R37.2 | IC5.4 30.53,7.98 31.01,7.49 v31.01,6.76
  Bottom 0.254: CN1.13 32,5.77 v31.01,6.76
HS_CAN_TX  (via drill 0.51)
  Top 0.305: IC5.1 25.91,6.71 27,5.61 v27,4.88
  Bottom 0.254: CN1.12 27,3.99 v27,4.88
J1850_BUS+  (via drill 0.51)
  Top 0.254: R26.1 51.69,22.48 CN1.25 | R26.1 50.91,20.81 50.57,20.47 v50.57,19.15 | v51.26,15.42 51.69,14.99 51.69,12.39 51.46,12.17 50.88,12.17 50.55,11.84 50.55,8.56 50.29,8.31 49.43,8.31 49.07,7.95 47.12,7.95 46.88,7.71 R14.2 | 47.05,7.71 R14.2 | D4.C 52.78,20.52 52.81,20.55 51.96,20.55 R26.1 | R14.2 46.13,7.71 R23.2
  Bottom 0.254: v51.26,15.42 51.26,18.47 v50.57,19.15
J1850_BUS+_TX
  Top 0.254: CN1.22 54.86,2.74 54.63,2.97 54.63,5.12 R25.2 55.63,7.39 55.35,7.67 55.35,9.19 Q5.1
K-LINE
  Top 0.254: CN1.28 42.16,22.2 40.98,21.02 Q9.3 40.55,19.3 R31.1 37.72,19.3 37.06,18.64 37.06,14.71 36.65,14.3 35.28,14.3 34.09,13.11 34.09,11.4 34.85,10.64 35.5,10.64 R35.1
L-LINE
  Top 0.254: R30.1 Q7.3 41.02,16.01 41.02,17.4 41.86,18.24 41.86,20.95 44.55,23.65 44.7,23.65 CN1.27
MS_CAN_HI
  Top 0.254: IC1.7 R4.2 14.8,15 13.95,15.85 13.95,18.11 16.76,20.93 CN1.38
MS_CAN_LO
  Top 0.254: CN1.37 20.57,23.11 20.57,15.62 19.95,15 R3.2 IC1.6
MS_CAN_RX
  Top 0.254: IC1.4 22,7.85 22.86,6.99 R1.2 22.59,5.07 22.55,5.11 19.58,5.11 19.3,4.83 19.3,3.56 19.05,3.3 18.54,3.3 CN1.7
MS_CAN_TX  (via drill 0.51)
  Top 0.254: IC1.1 v16.13,5.84
  Bottom 0.254: v16.13,5.84 16.13,3.81 16.76,3.17 17.65,3.17 CN1.8
N$1
  Top 0.254: R39.1 29.13,18.89
  Top 0.305: C8.1 28.93,18.68 R39.1
N$2
  Top 0.254: R41.2 32.51,12.38 32.51,10.69 31.6,9.78 31.6,9.17 31.62,9.14 31.76,9.14 Q10.3
N$3
  Top 0.254: Q7.1 42.85,15.31 43.86,15.31 R29.2
N$4
  Top 0.254: R30.2 R31.2 36.14,19.74
  Top 0.305: Q8.3 35.85,15.71 R30.2
N$5
  Top 0.254: R3.1 C2.1
N$6
  Top 0.254: D6.C 46.6,19.5 R27.1
N$7
  Top 0.254: R4.1 C3.1
N$8
  Top 0.254: R5.1 21.07,13.07 20.7,12.7 20.7,11.94 20.32,11.56 16.51,11.56 16.13,11.94 16.13,12.62 | R2.1 14.61,10.92 15.24,11.56 15.24,12.34 15.52,12.62 16.13,12.62 | 16.13,12.62 IC1.8
N$9
  Top 0.305: Q1.3 21.3,9.42 21.3,10.12 21.82,10.64 21.82,11.54 R5.2
N$12
  Top 0.254: R32.2 43.94,18.8 43.71,19.02 42.85,19.02 Q9.1
N$13
  Top 0.254: 53.96,10.21 R22.2 | Q5.3 54.71,9.98 54.53,10.16 54.06,10.16 R22.2 | R22.2 53.99,12.01 Q4.1
N$14
  Top 0.254: IC4.4 38.15,10.41 37.87,10.13 37.87,9.55 37.52,9.2 35.88,9.2 R35.2 35.62,9.02 34.95,9.02 34.62,8.69 D7.C
N$15
  Top 0.254: R41.1 31.01,12.39 30.4,11.79 26.31,11.79 25.91,12.19 IC5.8 25.82,13.45
  Top 0.305: R38.1 25.16,14.59 25.91,13.84 IC5.8
N$16
  Top 0.254: R19.2 R16.1 51.36,11.24 51.36,9.63 51.04,9.31 Q3.3
N$18  (via drill 0.41)
  Top 0.254: IC4.7 40.18,8.46 40.51,8.13 v40.51,7.34 40.51,6.76 40.39,6.63 D3.C 40.36,6.05 | v42.65,7.34 42.65,6.5 42.8,6.35 43.27,6.35 R23.1
  Bottom 0.254: v42.65,7.34 v40.51,7.34
N$19
  Top 0.254: R34.2 40.32,13.72 40.36,13.72 41.25,12.83 41.25,10.67 40.35,9.76 IC4.5 38.74,9.76 38.08,9.09 38.08,7.73 R36.1
N$21
  Top 0.254: D5.A 51.67,19.3 R26.2
N$26
  Top 0.254: R16.2 49.91,11.42 49.91,11.94 50.93,12.95 50.93,13.73 R17.2 49.78,13.74 49.4,14.13 IC3.4
N$27  (via drill 0.51)
  Top 0.254: v52.98,17.2 52.78,17.4 D4.A | v53.62,15.04 53.62,14.38 54.14,13.85 Q4.3
  Bottom 0.254: v53.62,15.04 53.62,16.56 v52.98,17.2
N$29
  Top 0.254: IC4.9 46.77,9.11 R14.1 46.91,9.26
  Top 0.305: D2.C R14.1
N$30  (via drill 0.41, 0.51)
  Top 0.254: R15.1 45.14,17.89 v45.14,16.43 | IC4.8 48.24,8.46 48.74,8.97 48.74,9.13 D1.C 48.82,9.73 47.83,10.72 47.83,15.19 v47.42,15.6
  Bottom 0.254: v47.42,15.6 46.58,16.43 v45.14,16.43
N$40
  Top 0.254: C9.1 25.91,17.21 R40.1
N$41
  Top 0.254: IC2.6 1.73,13.39 1.47,13.64 R8.2
N$43
  Top 0.254: IC4.6 38.91,9.11 38.66,8.87 38.66,7.87 39.06,7.47 39.06,6.64 | R21.2 37.83,6.49 37.82,6.5 39.03,6.5 R24.1
  Top 0.305: 39.06,6.64 R24.1
N$45  (via drill 0.51)
  Top 0.254: Q2.3 13.59,7.87 13.08,7.37 v12.52,7.37 | v7.75,8.13 R9.P$2
  Bottom 0.254: v12.52,7.37 11.76,8.13 v7.75,8.13
OUT
  Top 0.254: 52.45,15.82 53.72,15.82 54.22,16.33 IC3.7 IC3.6 | 52.45,15.82 52.05,15.82 51.54,16.33 IC3.2 IC3.3 | 52.45,15.82 52.53,15.75 52.53,13.83 R17.1 52.57,13.61 53.16,13.61 53.82,12.95 54.97,12.95 55.34,12.58 Q4.2 55.34,10.39 R22.1
  pour Top: 52.3,15.82 52.53,15.6 52.76,15.82
PWM/!VPW  (via drill 0.41)
  Top 0.254: CN1.18 44.7,5.04 R18.2 46,5.16 46.63,5.79 v48.97,5.79 | v53.77,6.15 53.01,6.15 Q3.1
  Bottom 0.254: v48.97,5.79 50.47,5.79 50.83,6.15 v53.77,6.15
PWM_RX  (via drill 0.41)
  Top 0.254: R13.2 IC4.14 43.76,12.36 43.36,11.96 43.36,8.59 44.32,7.62 v44.73,7.62 | CN1.20 48.46,2.85 48.46,4.93 48.08,5.31 47.17,5.31 v45.9,4.04
  Bottom 0.254: v44.73,7.62 44.73,5.21 v45.9,4.04
PWR_SAVE  (via drill 0.51)
  Top 0.305: 33.63,17.53 Q8.1 33.73,17.6 v33.73,18.92
  Bottom 0.305: v33.73,18.92 33.73,22.66 CN1.32
SW_CAN  (via drill 0.41)
  Top 0.254: 1.46,16.05 R8.1 | R8.1 0.75,16.04 0.51,15.8 0.51,13.74 1.37,12.88 1.37,12.12 | 1.37,10.78 C5.2 | IC2.7 1.37,12.12 | 1.37,12.12 1.37,10.76 C5.2 | C5.2 1.33,10.76 0.56,9.98 0.56,8.31 1.07,7.8 2.82,7.8 3.05,8.03 | R8.1 1.47,17.58 2.03,18.14 v4.14,18.14
  Top 0.305: 3.05,8.03 3.05,8.05 R9.P$1
  Bottom 0.254: CN1.41 9.14,20.83 7.85,19.53 4.65,19.53 4.14,19.02 v4.14,18.14
  pour Top: 1.37,11.61 1.37,12.62 1.88,12.12
SW_CAN_LOAD  (via drill 0.51)
  Top 0.254: R12.1 14.24,13.82 Q2.1 14.24,12.08 13.97,11.81 12.95,11.81 12.57,11.43 v12.57,9.14 | v14.22,6.99 CN1.6
  Bottom 0.254: v12.57,9.14 13.59,9.14 14.22,8.51 v14.22,6.99
SW_CAN_MODE0
  Top 0.254: IC2.2 9.86,12.12 10.12,11.85 R11.1 10.34,11.23 10.39,11.18 10.39,2.77 CN1.4
SW_CAN_MODE1
  Top 0.254: IC2.3 R10.1 10.12,12.74 10.87,11.99 10.87,2.34 CN1.5
SW_CAN_RX
  Top 0.254: R7.2 10.08,16.47 10.08,15.01 9.73,14.66 IC2.4 6.68,14.66 6.17,14.15 6.17,3.63 CN1.2
SW_CAN_TX
  Top 0.254: IC2.1 7.32,10.85 6.76,10.29 6.76,6.83 7.7,5.89 7.7,2.62 CN1.3
VPW_RX  (via drill 0.41)
  Top 0.254: 39.47,12.38 IC4.1 38.13,12.36 v38,12.5 37.6,12.89 R20.2 | CN1.19 47.24,4.06 v47.7,4.52
  Bottom 0.254: v38,12.5 39.75,10.74 45.01,10.74 45.97,9.78 45.97,5.69 47.14,4.52 v47.7,4.52

### Text on the board
tPlace: 44 | 43 | 42 | 41 | 40 | 39 | 38 | 37 | 36 | 35 | 34 | 33 | 32 | 31 | 30 | 29 | 28 | 27 | 26 | 25 | 24 | OBD Driver Module | (C) 2013 ScanTool.net LLC | Rev B | RoHS | 1 | 2 | 3 | 4 | 5 | 6 | 7 | 8 | 9 | 10 | 11 | 12 | 13 | 14 | 15 | 16 | 17 | 18 | 19 | 21 | 22